# EAGLE schematic keyboard_translator_V1 v5 (EAGLE 9.7.0)
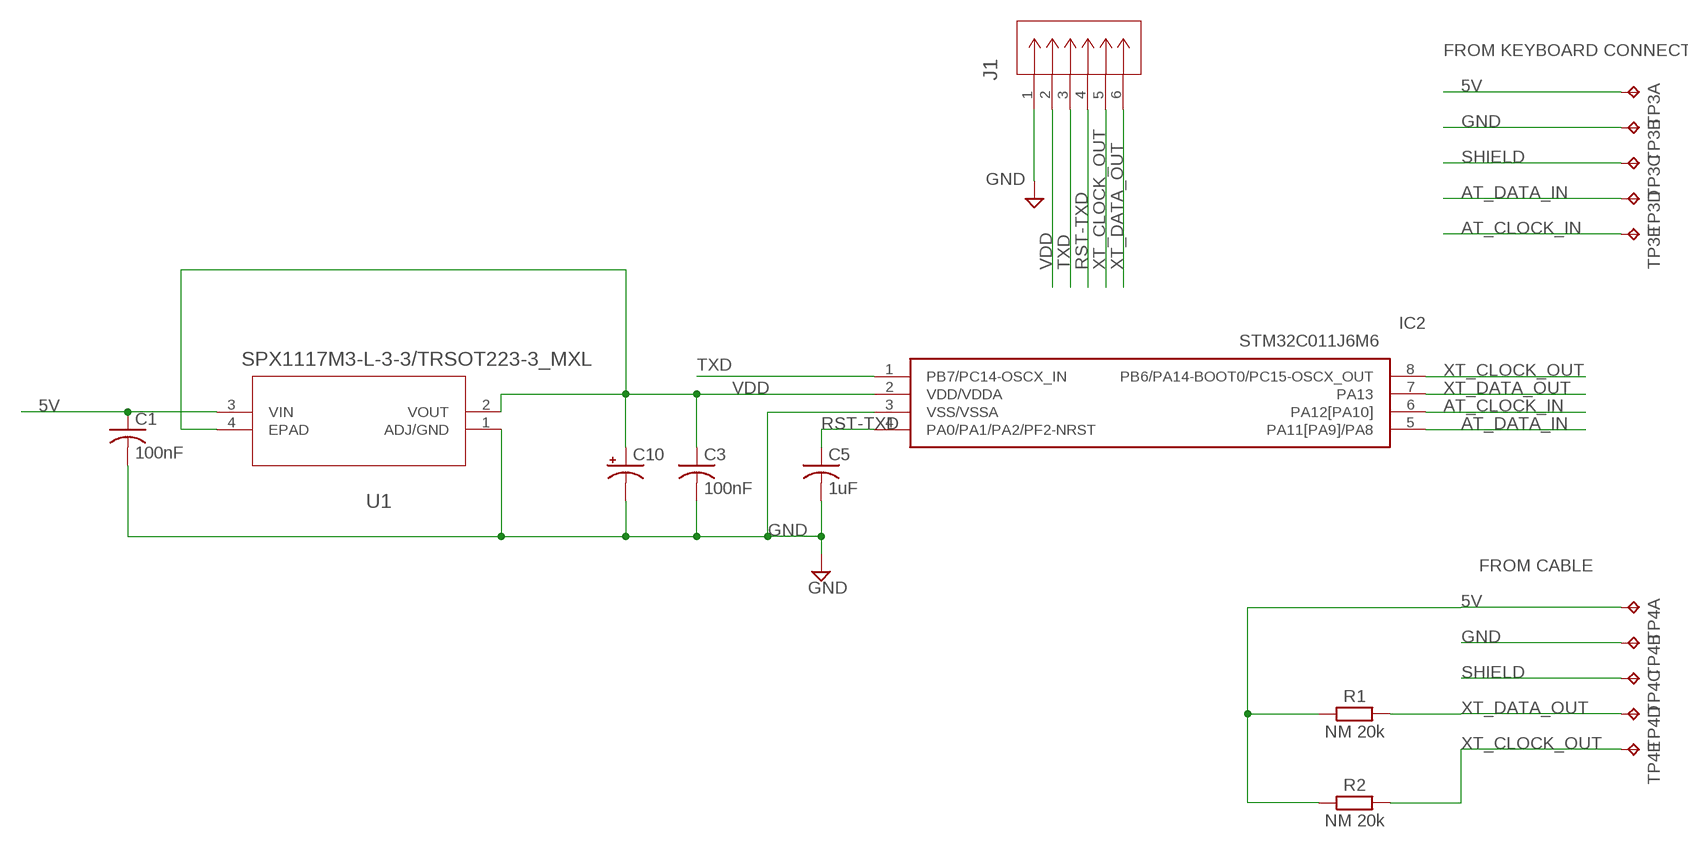
[diagram p0: schematic, sheet 1]

## Parts
C1  100nF  C-US_CHIP-0805(2012-METRIC)  [CAPC2012X110]
C3  100nF  C-US_CHIP-0805(2012-METRIC)  [CAPC2012X110]
C5  1uF  C-US_CHIP-0805(2012-METRIC)  [CAPC2012X110]
C10  C-POL-US_ECAP-8.5MM  [CAPAE830X1050N]
IC2  STM32C011J6M6  [SOIC127P600X175-8N]
J1  530470610CON_530470610_MOL  [CON_530470610_MOL]
R1  NM 20k  R_CHIP-0805(2012-METRIC)  [RESC2012X65]
R2  NM 20k  R_CHIP-0805(2012-METRIC)  [RESC2012X65]
TP3  TP5P5-25-13  [P5-25-13]
TP4  TP5P5-25-13  [P5-25-13]
U1  SPX1117M3-L-3-3/TRSOT223-3_MXL  [SOT223-3_MXL]

## Nets
5V: C1.1 R1.1 R2.1 TP3.TP-1 TP4.TP-1 U1.3(VIN)
AT_CLOCK_IN: IC2.6(PA12[PA10]) TP3.TP-5
AT_DATA_IN: IC2.5(PA11[PA9]/PA8) TP3.TP-4
GND: C1.2 C3.2 C5.2 C10.2(-) IC2.3(VSS/VSSA) J1.1 TP3.TP-2 TP4.TP-2 U1.1(ADJ/GND)
RST-TXD: C5.1 IC2.4(PA0/PA1/PA2/PF2-NRST) J1.4
SHIELD: TP3.TP-3 TP4.TP-3
TXD: IC2.1(PB7/PC14-OSCX_IN) J1.3
VDD: C3.1 C10.1(+) IC2.2(VDD/VDDA) J1.2 U1.2(VOUT) U1.4(EPAD)
XT_CLOCK_OUT: IC2.8(PB6/PA14-BOOT0/PC15-OSCX_OUT) J1.5 R2.2 TP4.TP-5
XT_DATA_OUT: IC2.7(PA13) J1.6 R1.2 TP4.TP-4

## Notes on the sheet
- FROM KEYBOARD CONNECTOR
- FROM CABLE

## Library data of the parts
C1 C3 C5 = Capacitor:C-US: Capacitor - ANSI; CATEGORY: Capacitor
C10 = Capacitor:C-POL-US: Capacitor Polarised - ANSI; CATEGORY: Capacitor
IC2 = STM32C011J6M6:STM32C011J6M6: Mainstream Arm Cortex-M0+ MCU with 32 Kbytes of Flash memory, 6 Kbytes RAM, 48 MHz CPU, 2x USART, timers, ADC, comm. I/F, 2-3.6V Source: Datasheet <https://www.st.com/resource/en/datasheet/stm32c011d6.pdf>; DESCRIPTION: Mainstream Arm Cortex-M0+ MCU with 32 Kbytes of Flash memory, 6 Kbytes RAM, 48 MHz CPU, 2x USART, timers, ADC, comm. I/F, 2-3.6V; HEIGHT: 1.75mm; MANUFACTURER_NAME: STMicroelectronics; MANUFACTURER_PART_NUMBER: STM32C011J6M6; MOUSER_PART_NUMBER: 511-STM32C011J6M6; MOUSER_PRICE-STOCK: https://www.mouser.co.uk/ProductDetail/STMicroelectronics/STM32C011J6M6?qs=IPgv5n7u5Qas2LaNYHG%2FbQ%3D%3D
J1 = Library:530470610; COPYRIGHT: Copyright (C) 2024 Ultra Librarian. All rights reserved.; MANUFACTURER_PART_NUMBER: 530470610; MFR_NAME: Molex Connector Corporation
R1 R2 = Resistor:R: Resistor Fixed - Generic; CATEGORY: Resistor; SUB-CATEGORY: Fixed
TP3 TP4 = testpad:TP5: Test pad
U1 = 2023-10-17_10-46-12_Library:SPX1117M3-L-3-3/TR; COPYRIGHT: Copyright (C) 2023 Ultra Librarian. All rights reserved.; MANUFACTURER_PART_NUMBER: SPX1117M3-L-3-3/TR; MFR_NAME: MaxLinear / Exar